# EAGLE design RAM_final_rev02 (EAGLE 9.6.0)
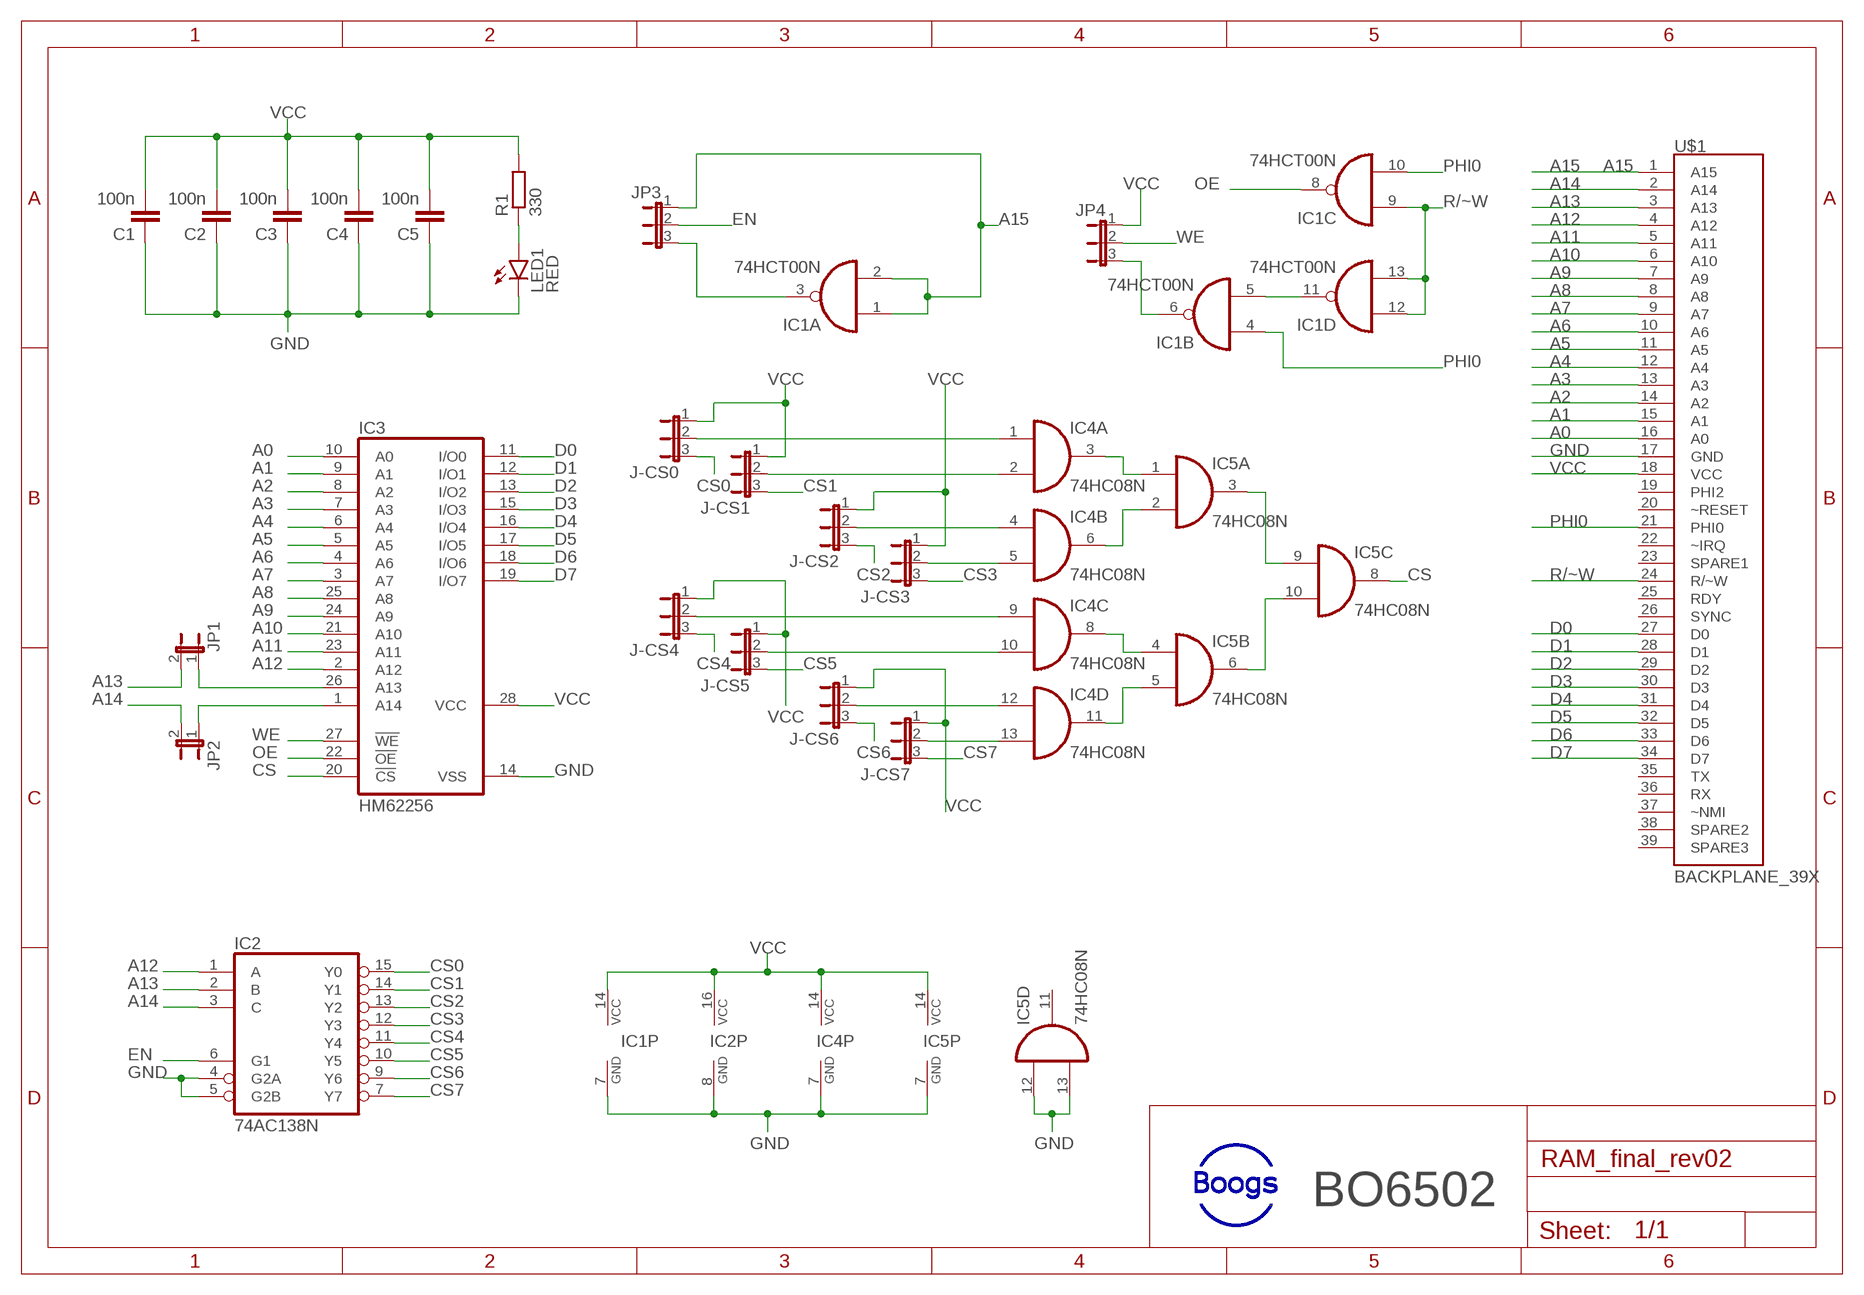
[diagram p0: schematic, sheet 1]

## Parts
C1  100n  C-EU025-025X050  [C025-025X050]
C2  100n  C-EU025-025X050  [C025-025X050]
C3  100n  C-EU025-025X050  [C025-025X050]
C4  100n  C-EU025-025X050  [C025-025X050]
C5  100n  C-EU025-025X050  [C025-025X050]
IC1  74HCT00N  [DIL14]
IC2  74AC138N  [DIL16]
IC3  HM62256  62256P  [DIL28-6]
IC4  74HC08N  [DIL14]
IC5  74HC08N  [DIL14]
J-CS0  J-CS0  JP2E  [JP2]
J-CS1  J-CS1  JP2E  [JP2]
J-CS2  J-CS2  JP2E  [JP2]
J-CS3  J-CS3  JP2E  [JP2]
J-CS4  J-CS4  JP2E  [JP2]
J-CS5  J-CS5  JP2E  [JP2]
J-CS6  J-CS6  JP2E  [JP2]
J-CS7  J-CS7  JP2E  [JP2]
JP1  JP1  JP1E  [JP1]
JP2  JP2  JP1E  [JP1]
JP3  JP3  JP2E  [JP2]
JP4  JP4  JP2E  [JP2]
LED1  RED  LED5MM  [LED5MM]
R1  330  R-EU_0207/10  [0207/10]
U$1  BACKPLANE_39X  [BP_39X]

## Nets
A0: IC3.10(A0) U$1.16(A0)
A1: IC3.9(A1) U$1.15(A1)
A2: IC3.8(A2) U$1.14(A2)
A3: IC3.7(A3) U$1.13(A3)
A4: IC3.6(A4) U$1.12(A4)
A5: IC3.5(A5) U$1.11(A5)
A6: IC3.4(A6) U$1.10(A6)
A7: IC3.3(A7) U$1.9(A7)
A8: IC3.25(A8) U$1.8(A8)
A9: IC3.24(A9) U$1.7(A9)
A10: IC3.21(A10) U$1.6(A10)
A11: IC3.23(A11) U$1.5(A11)
A12: IC2.1(A) IC3.2(A12) U$1.4(A12)
A13: IC2.2(B) JP1.2 U$1.3(A13)
A14: IC2.3(C) JP2.2 U$1.2(A14)
A15: IC1.1(A:I0) IC1.2(A:I1) JP3.1 U$1.1(A15)
CS: IC3.20(!CS) IC5.8(C:O)
CS0: IC2.15(Y0) J-CS0.3
CS1: IC2.14(Y1) J-CS1.3
CS2: IC2.13(Y2) J-CS2.3
CS3: IC2.12(Y3) J-CS3.3
CS4: IC2.11(Y4) J-CS4.3
CS5: IC2.10(Y5) J-CS5.3
CS6: IC2.9(Y6) J-CS6.3
CS7: IC2.7(Y7) J-CS7.3
D0: IC3.11(I/O0) U$1.27(D0)
D1: IC3.12(I/O1) U$1.28(D1)
D2: IC3.13(I/O2) U$1.29(D2)
D3: IC3.15(I/O3) U$1.30(D3)
D4: IC3.16(I/O4) U$1.31(D4)
D5: IC3.17(I/O5) U$1.32(D5)
D6: IC3.18(I/O6) U$1.33(D6)
D7: IC3.19(I/O7) U$1.34(D7)
EN: IC2.6(G1) JP3.2
GND: C1.1 C2.1 C3.1 C4.1 C5.1 IC1.7(P:GND) IC2.4(G2A) IC2.5(G2B) IC2.8(GND) IC3.14(VSS) IC4.7(P:GND) IC5.7(P:GND) IC5.12(D:I0) IC5.13(D:I1) LED1.K(C) U$1.17(GND)
N$1: IC3.26(A13) JP1.1
N$2: IC1.5(B:I1) IC1.11(D:O)
N$3: IC1.3(A:O) JP3.3
N$4: IC1.6(B:O) JP4.3
N$5: IC4.3(A:O) IC5.1(A:I0)
N$6: LED1.A R1.1
N$7: IC4.6(B:O) IC5.2(A:I1)
N$8: IC4.8(C:O) IC5.4(B:I0)
N$9: IC3.1(A14) JP2.1
N$10: IC4.11(D:O) IC5.5(B:I1)
N$11: IC5.3(A:O) IC5.9(C:I0)
N$12: IC5.6(B:O) IC5.10(C:I1)
N$13: IC4.1(A:I0) J-CS0.2
N$14: IC4.2(A:I1) J-CS1.2
N$15: IC4.4(B:I0) J-CS2.2
N$16: IC4.5(B:I1) J-CS3.2
N$17: IC4.9(C:I0) J-CS4.2
N$18: IC4.10(C:I1) J-CS5.2
N$19: IC4.12(D:I0) J-CS6.2
N$20: IC4.13(D:I1) J-CS7.2
OE: IC1.8(C:O) IC3.22(!OE)
PHI0: IC1.4(B:I0) IC1.10(C:I1) U$1.21(PHI0)
R/~W: IC1.9(C:I0) IC1.12(D:I0) IC1.13(D:I1) U$1.24(R/~W)
VCC: C1.2 C2.2 C3.2 C4.2 C5.2 IC1.14(P:VCC) IC2.16(VCC) IC3.28(VCC) IC4.14(P:VCC) IC5.14(P:VCC) J-CS0.1 J-CS1.1 J-CS2.1 J-CS3.1 J-CS4.1 J-CS5.1 J-CS6.1 J-CS7.1 JP4.1 R1.2 U$1.18(VCC)
WE: IC3.27(!WE) JP4.2
Unconnected: IC5.11(D:O) U$1.19(PHI2) U$1.20(~RESET) U$1.22(~IRQ) U$1.23(SPARE1) U$1.25(RDY) U$1.26(SYNC) U$1.35(TX) U$1.36(RX) U$1.37(~NMI) U$1.38(SPARE2) U$1.39(SPARE3)

## Notes on the sheet
- BO6502

## Library data of the parts
C1-C5 = rcl:C-EU: CAPACITOR, European symbol; SPICEPREFIX: C
IC1 = 74xx-eu:74*00: Quad 2-input NAND gate
IC2 = 74xx-eu:74*138: 3-line to 8-line DECODER/DEMULTIPLEXER
IC3 = memory-hitachi:62256P: MEMORY; OC_FARNELL: unknown; OC_NEWARK: unknown
IC4 IC5 = 74xx-eu:74*08: Quad 2-input AND gate
J-CS0 J-CS1-J-CS7 JP3 JP4 = jumper:JP2E: JUMPER
JP1 JP2 = jumper:JP1E: JUMPER
LED1 = led:LED: LED OSRAM: - CHIPLED LG R971, LG N971, LY N971, LG Q971, LY Q971, LO R971, LY R971 LH N974, LH R974 LS Q976, LO Q976, LY Q976 LO Q996 - Hyper CHIPLED LW Q18S LB Q993, LB Q99A, LB R99A - SideLED LS A670, LO A670, LY A670, LG A670, LP A670 LB A673, LV A673, LT A673, LW A673 LH A674 LY A675 LS A676, LA A676, LO A676, LY A676, LW A676 LS A679, LY A679, LG A679 - Hyper Micro SIDELED® LS Y876, LA Y876, LO Y876, LY Y876 LT Y87S - SmartLED LW L88C, LW L88S LB L89C, LB L89S, LG L890 LS L89K, LO L89K, LY L89K LS L896, LA L896, LO L896, LY L896 - TOPLED LS T670, LO T670, LY T670, LG T670, LP T670 LSG T670, LSP T670, LSY T670, LOP T670, LYG T670 LG T671, LOG T671, LSG T671 LB T673, LV T673, LT T673, LW T673 LH T674 LS T676, LA T676, LO T676, LY T676, LB T676, LH T676, LSB T676, LW T676 LB T67C, LV T67C, LT T67C, LS T67K, LO T67K, LY T67K, LW E67C LS E67B, LA E67B, LO E67B, LY E67B, LB E67C, LV E67C, LT E67C LW T67C LS T679, LY T679, LG T679 LS T770, LO T770, LY T770, LG T770, LP T770 LB T773, LV T773, LT T773, LW T773 LH T774 LS E675, LA E675, LY E675, LS T675 LS T776, LA T776, LO T776, LY T776, LB T776 LHGB T686 LT T68C, LB T68C - Hyper Mini TOPLED® LB M676 - Mini TOPLED Santana® LG M470 LS M47K, LO M47K, LY M47K Source: http://www.osram.convergy.de LUXEON: - LUMILED® LXK2-PW12-R00, LXK2-PW12-S00, LXK2-PW14-U00, LXK2-PW14-V00 LXK2-PM12-R00, LXK2-PM12-S00, LXK2-PM14-U00 LXK2-PE12-Q00, LXK2-PE12-R00, LXK2-PE12-S00, LXK2-PE14-T00, LXK2-PE14-U00 LXK2-PB12-K00, LXK2-PB12-L00, LXK2-PB12-M00, LXK2-PB14-N00, LXK2-PB14-P00, LXK2-PB14-Q00 LXK2-PR12-L00, LXK2-PR12-M00, LXK2-PR14-Q00, LXK2-PR14-R00 LXK2-PD12-Q00, LXK2-PD12-R00, LXK2-PD12-S00 LXK2-PH12-R00, LXK2-PH12-S00 LXK2-PL12-P00, LXK2-PL12-Q00, LXK2-PL12-R00 Source: www.luxeon.com KINGBRIGHT: KA-3528ASYC Source: www.kingbright.com
R1 = rcl:R-EU_: RESISTOR, European symbol; SPICEPREFIX: R
U$1 = 65xx_family:BACKPLANE_39X; A15: A15

## Board
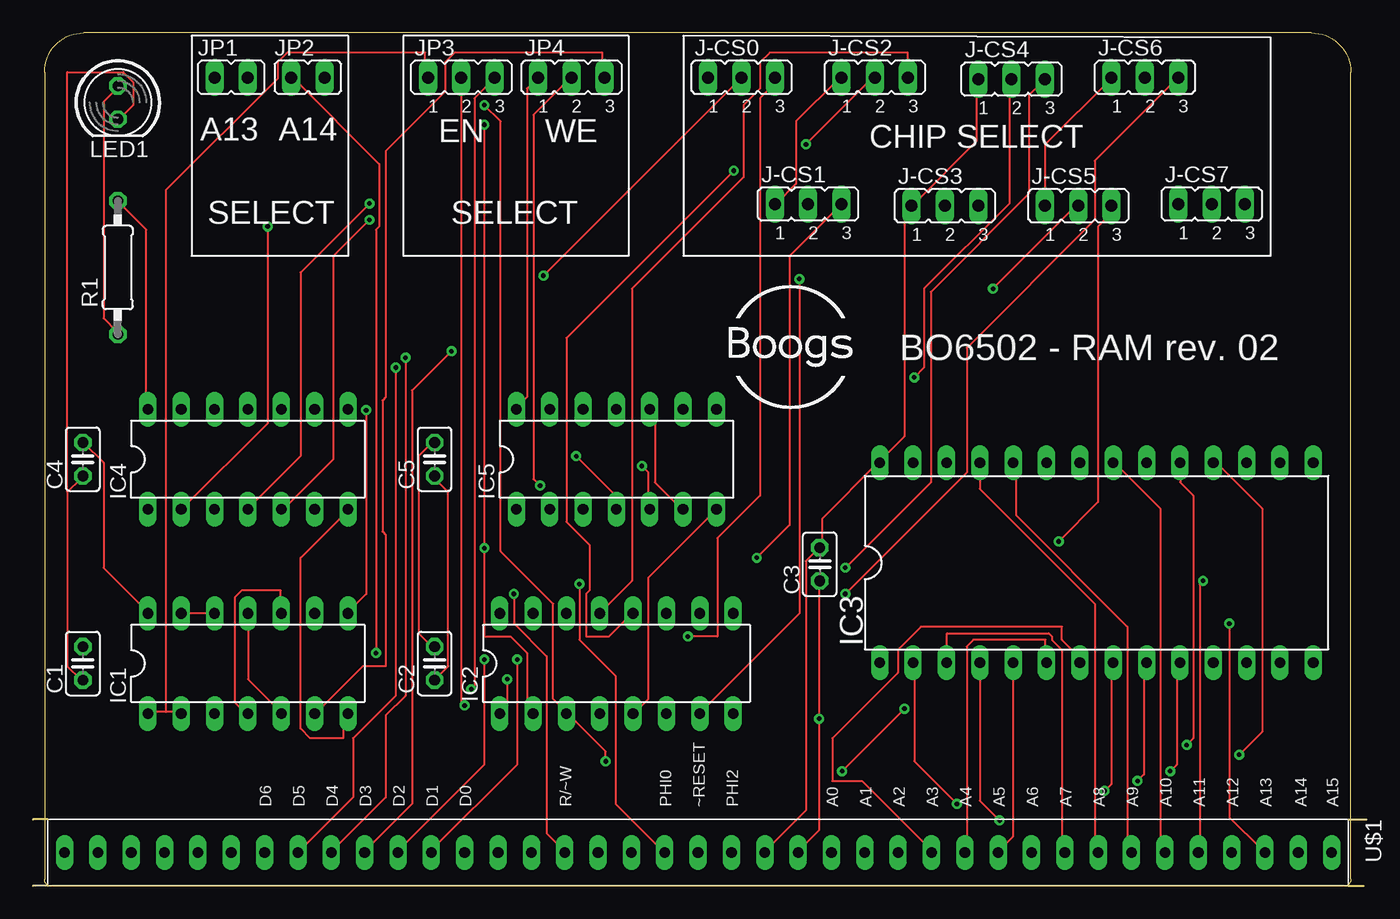
[diagram p1: board, top side]
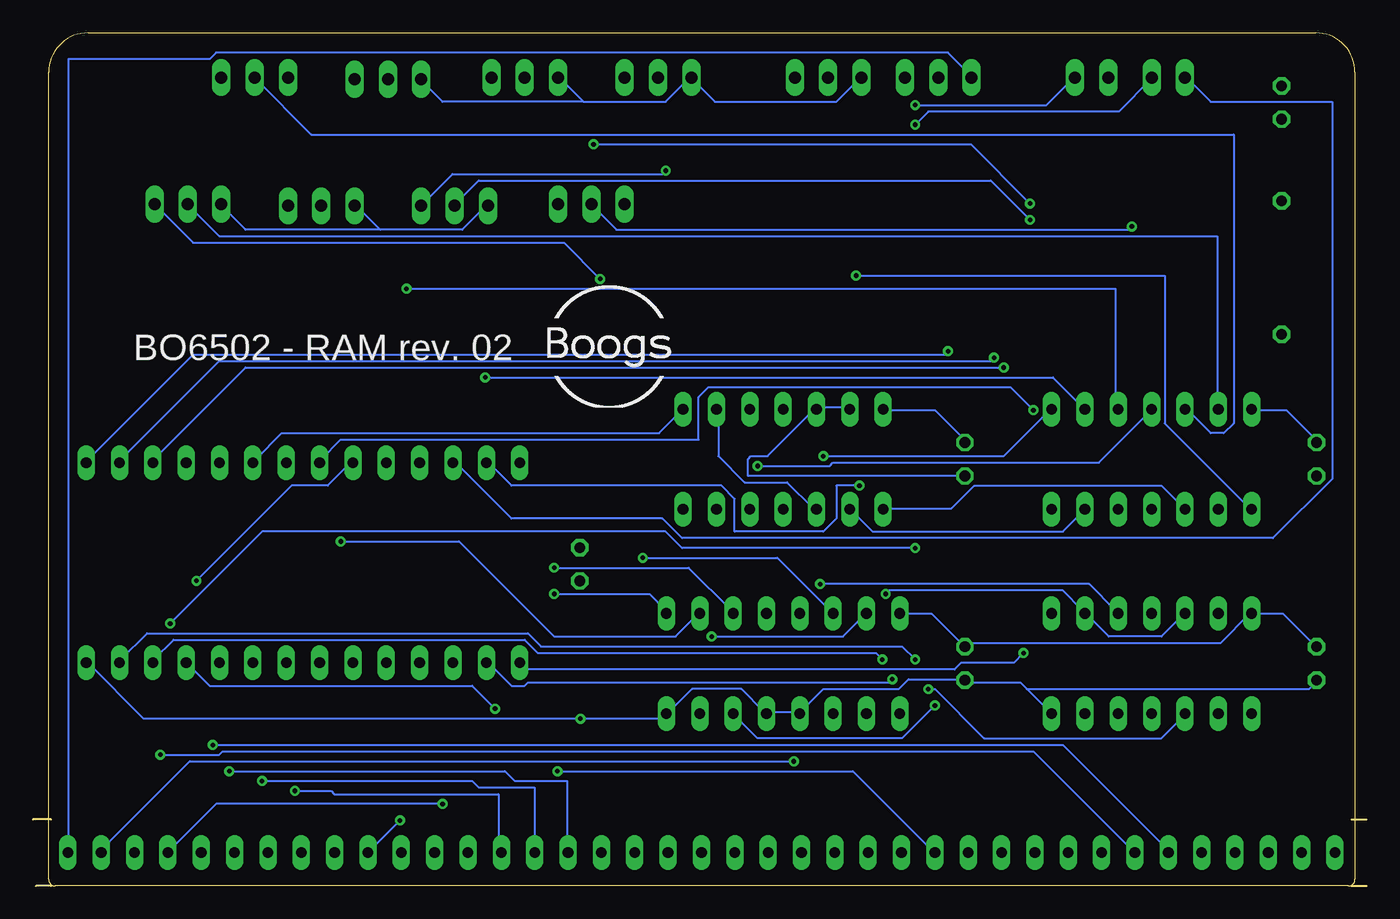
[diagram p2: board, bottom side, seen from below]

Size 101.6 x 65 mm. Coordinates in mm from the lower left corner, seen from the top.
Outline: 1.14,5.08 0,5.08
Outline: 1.14,0 0,0
Outline: 100.2,5.08 101.6,5.08
Outline: 100.2,0 101.35,0
Outline: 1.39,0 99.89,0 arc90 100.39,0.5 100.39,62 arc90 97.39,65 3.89,65 arc90 0.89,62 0.89,0.5 arc90 1.39,0
Copper layers (1*16): Top 0.035mm / dielectric 1.5mm / Bottom 0.035mm
Design rules "default *": minimum track width 6mil, minimum drill 0.35mm, track to track 10mil, track to pad 10mil, pad to pad 10mil, via to via 10mil, smd to smd 6mil, copper to edge 40mil, drill to drill 6mil, minimum pad ring 10mil, minimum via ring 8mil, stop-mask expansion 4mil, vias tented up to drill 15mil, thermal gap 10mil

### Footprints (pad centres in the part's own frame; a part is rotated, then mirrored left to right if it is on the bottom)
C025-025X050 = drill 0.813 octagon: 1 -1.27,0; 2 1.27,0
DIL14 = drill 0.813 long: 1 -7.62,-3.81; 2 -5.08,-3.81; 3 -2.54,-3.81; 4 0,-3.81; 5 2.54,-3.81; 6 5.08,-3.81; 7 7.62,-3.81; 8 7.62,3.81; 9 5.08,3.81; 10 2.54,3.81; 11 0,3.81; 12 -2.54,3.81; 13 -5.08,3.81; 14 -7.62,3.81
DIL16 = drill 0.813 long: 1 -8.89,-3.81; 2 -6.35,-3.81; 3 -3.81,-3.81; 4 -1.27,-3.81; 5 1.27,-3.81; 6 3.81,-3.81; 7 6.35,-3.81; 8 8.89,-3.81; 9 8.89,3.81; 10 6.35,3.81; 11 3.81,3.81; 12 1.27,3.81; 13 -1.27,3.81; 14 -3.81,3.81; 15 -6.35,3.81; 16 -8.89,3.81
DIL28-6 = drill 0.813 long: 1 -16.51,-7.62; 2 -13.97,-7.62; 3 -11.43,-7.62; 4 -8.89,-7.62; 5 -6.35,-7.62; 6 -3.81,-7.62; 7 -1.27,-7.62; 8 1.27,-7.62; 9 3.81,-7.62; 10 6.35,-7.62; 11 8.89,-7.62; 12 11.43,-7.62; 13 13.97,-7.62; 14 16.51,-7.62; 15 16.51,7.62; 16 13.97,7.62; 17 11.43,7.62; 18 8.89,7.62; 19 6.35,7.62; 20 3.81,7.62; 21 1.27,7.62; 22 -1.27,7.62; 23 -3.81,7.62; 24 -6.35,7.62; 25 -8.89,7.62; 26 -11.43,7.62; 27 -13.97,7.62; 28 -16.51,7.62
JP2 = drill 0.914 long: 1 -2.54,0; 2 0,0; 3 2.54,0
JP1 = drill 0.914 long: 1 0,-1.27; 2 0,1.27
LED5MM = drill 0.813 octagon: A -1.27,0; K 1.27,0
0207/10 = drill 0.813 octagon: 1 -5.08,0; 2 5.08,0
BP_39X = drill 0.813 long: 1 1.27,59.69; 2 1.27,57.15; 3 1.27,54.61; 4 1.27,52.07; 5 1.27,49.53; 6 1.27,46.99; 7 1.27,44.45; 8 1.27,41.91; 9 1.27,39.37; 10 1.27,36.83; 11 1.27,34.29; 12 1.27,31.75; 13 1.27,29.21; 14 1.27,26.67; 15 1.27,24.13; 16 1.27,21.59; 17 1.27,19.05; 18 1.27,16.51; 19 1.27,13.97; 20 1.27,11.43; 21 1.27,8.89; 22 1.27,6.35; 23 1.27,3.81; 24 1.27,1.27; 25 1.27,-1.27; 26 1.27,-3.81; 27 1.27,-6.35; 28 1.27,-8.89; 29 1.27,-11.43; 30 1.27,-13.97; 31 1.27,-16.51; 32 1.27,-19.05; 33 1.27,-21.59; 34 1.27,-24.13; 35 1.27,-26.67; 36 1.27,-29.21; 37 1.27,-31.75; 38 1.27,-34.29; 39 1.27,-36.83

### Placement (x,y rotation side)
C1  3.81,16.95 90 top
C2  30.61,16.95 90 top
C3  59.94,24.51 90 top
C4  3.81,32.51 90 top
C5  30.61,32.51 90 top
IC1  16.38,16.95 0 top
IC2  44.45,16.95 0 top
IC3  81.03,24.64 0 top
IC4  16.38,32.51 0 top
IC5  44.45,32.51 0 top
J-CS0  53.98,61.59 0 top
J-CS1  59.05,51.94 0 top
J-CS2  64.14,61.59 0 top
J-CS3  69.47,51.82 0 top
J-CS4  74.55,61.47 0 top
J-CS5  79.63,51.82 0 top
J-CS6  84.71,61.59 0 top
J-CS7  89.79,51.94 0 top
JP1  15.11,61.59 270 top
JP2  20.95,61.59 270 top
JP3  32.64,61.59 0 top
JP4  41.02,61.59 0 top
LED1  6.48,59.69 270 top
R1  6.48,47.12 90 top
U$1  39.24,3.81 270 top

### Tracks (layer width: path | path; a pad name or v marks a point on that pad's centre or on a via)
A0  (via drill 0.35)
  Top 0.152: v86.64,8.75 87.14,9.25 87.14,17 IC3.10
  Bottom 0.152: v86.64,8.75 65.64,8.75 64.89,8 60.89,8 60.89,2.75 U$1.16
A1  (via drill 0.35)
  Top 0.152: v84.14,8 84.64,8.5 84.64,17 IC3.9
  Bottom 0.152: v84.14,8 68.14,8 67.64,7.5 63.39,7.5 63.39,2.75 U$1.15
A2  (via drill 0.35)
  Top 0.152: v81.64,7.25 82.14,7.75 82.14,17 IC3.8
  Bottom 0.152: v81.64,7.25 78.89,7.25 78.64,7 66.14,7 66.14,2.75 U$1.14
A3
  Top 0.152: U$1.13 68.39,2.75 63.14,8 60.89,8 60.89,11.25 65.89,16.25 65.89,18 67.64,19.75 78.39,19.75 78.39,18.75 79.64,17.5 79.64,17.25 IC3.7
A4
  Top 0.152: U$1.12 71.14,2.75 71.14,18.25 71.64,18.75 77.14,18.75 77.14,17.25 IC3.6
A5
  Top 0.152: U$1.11 73.64,2.75 74.64,3.75 74.64,17 IC3.5
A6  (via drill 0.35)
  Top 0.152: v73.64,5 72.14,6.5 72.14,17 IC3.4
  Bottom 0.152: v73.64,5 75.89,2.75 U$1.10
A7
  Top 0.152: U$1.9 78.39,2.75 78.39,18 77.64,18.75 77.64,19 77.39,19.25 69.64,19.25 69.64,17.25 IC3.3
A8
  Top 0.152: U$1.8 81.14,2.75 80.89,3 80.89,21.5 72.14,30.25 IC3.25
A9
  Top 0.152: U$1.7 83.64,2.75 83.39,3 83.39,19.75 74.89,28.25 74.89,32.25 IC3.24
A10
  Top 0.152: U$1.6 86.14,2.75 85.89,3 85.89,28.75 82.39,32.25 IC3.21
A11  (via drill 0.35)
  Top 0.152: v89.14,23.25 88.89,23 88.89,2.75 U$1.5
  Bottom 0.152: v89.14,23.25 81.89,30.5 79.14,30.5 77.39,32.25 IC3.23
A12  (via drill 0.35)
  Top 0.152: v36.14,15.75 36.14,13.75 35.64,13.25 IC2.1 | v70.39,6.25 67.14,9.5 67.14,17 IC3.2
  Bottom 0.152: v36.14,15.75 36.39,15.5 63.89,15.5 64.14,15.25 65.14,15.25 66.89,17 IC3.2 | v70.39,6.25 87.64,6.25 91.14,2.75 U$1.4
A13  (via drill 0.35)
  Top 0.152: v34.39,58 v34.39,25.75 34.39,19 36.39,19 37.64,17.75 37.64,13.5 37.89,13.25 IC2.2 | v91.14,20 91.14,5.25 93.64,2.75 U$1.3
  Bottom 0.152: v34.39,58 33.39,59 18.89,59 16.39,61.5 JP1.2 | v91.14,20 84.14,27 53.39,27 52.14,25.75 v34.39,25.75
A14  (via drill 0.35)
  Top 0.152: v43.64,9.5 43.64,10.25 40.89,13 IC2.3 40.64,13.25 39.64,14.25 39.64,21.5 35.64,25.5 35.64,58.25 v34.39,59.5
  Bottom 0.152: v43.64,9.5 89.64,9.5 96.39,2.75 U$1.2 | v34.39,59.5 24.39,59.5 22.39,61.5 JP2.2
A15
  Top 0.152: 10.14,13.25 11.14,13.25 IC1.2 | 10.14,13.25 8.89,13.25 IC1.1 | 10.14,13.25 10.14,53 18.64,61.5 18.64,62.75 19.39,63.5 29.89,63.5 29.89,61.75 JP3.1
  Bottom 0.152: U$1.1 98.89,2.75 98.89,63 88.14,63 87.64,63.5 31.89,63.5 30.14,61.75 JP3.1
CS
  Bottom 0.152: IC5.8 52.14,36.25 53.89,34.5 82.64,34.5 84.64,32.5 IC3.20
CS0  (via drill 0.35)
  Top 0.152: v49.89,19 52.14,19 52.14,26.5 55.39,29.75 55.39,60 56.39,61 56.39,61.5 J-CS0.3
  Bottom 0.152: v49.89,19 39.89,19 38.14,20.75 IC2.15
CS1  (via drill 0.35)
  Top 0.152: v55.14,25 57.64,27.5 57.64,48 61.39,51.75 J-CS1.3
  Bottom 0.152: v55.14,25 44.89,25 40.89,21 IC2.14
CS2
  Top 0.152: IC2.13 43.39,21 45.64,23.25 45.64,45.5 54.14,54 54.14,59.5 55.39,60.75 55.39,62.75 56.14,63.5 66.64,63.5 66.64,61.75 J-CS2.3
CS3  (via drill 0.35)
  Top 0.152: v53.39,54.5 40.64,41.75 40.64,27.75 42.39,26 42.39,22.5 42.14,22.25 42.14,19 43.89,19 45.64,20.75 IC2.12
  Bottom 0.152: v53.39,54.5 53.64,54.25 69.64,54.25 71.89,52 J-CS3.3
CS4  (via drill 0.35)
  Top 0.152: v61.89,24.25 68.39,30.75 68.39,45.25 75.89,52.75 75.89,60.25 76.89,61.25 J-CS4.3
  Bottom 0.152: v61.89,24.25 51.64,24.25 48.39,21 IC2.11
CS5  (via drill 0.35)
  Top 0.152: v78.14,26.25 81.14,29.25 81.14,50.25 82.14,51.25 82.14,51.75 J-CS5.3
  Bottom 0.152: v78.14,26.25 69.14,26.25 61.89,19 52.64,19 50.89,20.75 IC2.10
CS6  (via drill 0.35)
  Top 0.152: v61.89,22.25 71.14,31.5 71.14,41 80.89,50.75 80.89,55.25 87.14,61.5 J-CS6.3
  Bottom 0.152: v61.89,22.25 54.64,22.25 53.39,21 IC2.9
CS7  (via drill 0.35)
  Top 0.152: v58.39,46.25 58.39,20.75 50.89,13.25 IC2.7
  Bottom 0.152: v58.39,46.25 61.14,49 89.39,49 92.14,51.75 J-CS7.3
D0  (via drill 0.35)
  Top 0.152: v66.39,13.5 v61.64,8.75
  Bottom 0.152: v61.64,8.75 39.14,8.75 33.14,2.75 U$1.27 | v66.39,13.5 68.14,15.25 88.14,15.25 89.89,17 IC3.11
D1  (via drill 0.35)
  Top 0.152: v36.89,17.25 36.89,9.25 30.39,2.75 U$1.28
  Bottom 0.152: v36.89,17.25 37.39,17.75 63.14,17.75 64.14,18.75 90.89,18.75 92.39,17.25 IC3.12
D2  (via drill 0.35)
  Top 0.152: v34.39,17.25 34.39,9.25 27.89,2.75 U$1.29
  Bottom 0.152: v34.39,17.25 35.39,18.25 62.89,18.25 63.89,19.25 92.89,19.25 94.89,17.25 IC3.13
D3  (via drill 0.35)
  Top 0.152: v31.89,40.75 28.89,37.75 28.89,6.25 25.39,2.75 U$1.30
  Bottom 0.152: v31.89,40.75 32.14,40.5 89.39,40.5 97.39,32.5 IC3.15
D4  (via drill 0.35)
  Top 0.152: v28.39,40.25 28.39,14.5 26.89,13 26.89,6.75 22.89,2.75 U$1.31
  Bottom 0.152: v28.39,40.25 28.64,40 87.39,40 94.89,32.5 IC3.16
D5  (via drill 0.35)
  Top 0.152: v27.64,39.5 27.64,14.5 24.39,11.25 24.39,6.75 20.39,2.75 U$1.32
  Bottom 0.152: v27.64,39.5 85.39,39.5 92.39,32.5 IC3.17
D6  (via drill 0.35)
  Top 0.152: v91.89,10 93.64,11.75 93.64,28.75 90.14,32.25 IC3.18
  Bottom 0.152: v91.89,10 87.39,10 87.14,10.25 25.39,10.25 17.89,2.75 U$1.33
D7  (via drill 0.35)
  Top 0.152: v87.89,10.75 88.39,11.25 88.39,29.75 87.39,30.75 IC3.19
  Bottom 0.152: v87.89,10.75 23.14,10.75 15.14,2.75 U$1.34
EN  (via drill 0.35)
  Top 0.152: v32.89,13.75 32.64,14 JP3.2
  Bottom 0.152: v32.89,13.75 35.39,11.25 46.39,11.25 48.14,13 IC2.6
GND  (via drill 0.35)
  Top 0.152: 2.64,30 2.64,16.75 3.64,15.75 C1.1 | 2.64,30 3.64,31 C4.1 | 2.64,30 2.64,62 6.89,62 7.64,61.25 7.64,59.5 6.64,58.5 LED1.K | IC4.7 23.89,28.5 20.39,25 20.39,12 21.14,11.25 23.64,11.25 23.64,12.75 23.89,13 IC1.7 | C5.1 30.64,31 31.64,30 31.64,16.75 30.64,15.75 C2.1 | U$1.17 58.39,2.75 59.89,4.25 v59.89,12.75 59.89,23 C3.1 | IC5.7 51.89,28.5 46.89,23.5 46.89,14.25 45.89,13.25 IC2.5
  Bottom 0.152: IC5.13 39.39,36.5 41.89,36.5 IC5.12 42.14,36.25 45.64,32.75 46.89,32.75 47.14,32.5 47.14,31.25 30.64,31.25 C5.1 | 25.89,15 26.39,15.5 30.39,15.5 C2.1 30.64,15.75 34.89,15.75 35.64,15 41.39,15 43.14,13.25 IC2.4 43.39,13.25 45.64,13.25 IC2.5 45.89,13.25 47.64,15 51.39,15 53.14,13.25 IC2.8 53.39,13 53.64,12.75 v59.89,12.75 93.14,12.75 97.39,17 IC3.14 | 25.89,15 24.14,13.25 IC1.7 | 25.89,15 4.39,15 3.89,15.5 C1.1
N$1
  Bottom 0.152: IC3.26 69.39,32.25 65.14,28 53.64,28 52.14,26.5 7.14,26.5 2.64,31 2.64,59.75 11.89,59.75 13.64,61.5 JP1.1
N$2
  Top 0.152: IC1.5 18.89,13.25 16.39,15.75 IC1.11
N$3  (via drill 0.35)
  Top 0.152: v33.39,15 33.64,15.25 33.64,60 35.14,61.5 JP3.3
  Bottom 0.152: v33.39,15 32.89,15 29.14,11.25 15.64,11.25 13.89,13 IC1.3
N$4
  Top 0.152: IC1.6 21.64,13.25 25.14,16.75 26.89,16.75 26.89,26.75 26.64,27 26.64,37 26.89,37.25 26.89,56 31.39,60.5 31.39,62.75 32.14,63.5 43.39,63.5 43.39,61.75 JP4.3
N$5
  Bottom 0.152: IC4.3 13.89,28.75 15.64,30.5 29.89,30.5 31.64,28.75 36.64,28.75 IC5.1
N$6
  Top 0.152: R1.1 6.39,42.25 5.39,43.25 5.39,59.75 6.39,60.75 LED1.A
N$7
  Bottom 0.152: IC4.6 21.64,28.5 23.14,27 37.64,27 39.14,28.5 IC5.2
N$8  (via drill 0.35)
  Top 0.152: v41.39,32.75 44.39,29.75 44.39,28.75 IC5.4
  Bottom 0.152: v41.39,32.75 27.64,32.75 24.14,36.25 IC4.8
N$9  (via drill 0.35)
  Top 0.152: v26.14,17.75 26.14,50 26.39,50.25 26.39,55 19.89,61.5 JP2.1
  Bottom 0.152: v26.14,17.75 26.89,17 30.89,17 31.39,16.5 63.89,16.5 64.39,17 IC3.1
N$10  (via drill 0.35)
  Top 0.152: v46.39,32 46.89,31.5 46.89,28.75 IC5.5
  Bottom 0.152: v46.39,32 40.89,32 40.64,32.25 20.39,32.25 16.39,36.25 IC4.11
N$11
  Bottom 0.152: IC5.3 42.14,28.75 44.14,30.75 47.39,30.75 49.39,32.75 49.39,36.25 IC5.9
N$12
  Top 0.152: IC5.6 49.39,28.75 47.39,30.75 47.39,36 47.14,36.25 IC5.10
N$13  (via drill 0.35)
  Top 0.152: v38.89,46.5 53.89,61.5 J-CS0.2
  Bottom 0.152: v38.89,46.5 15.39,46.5 15.39,35.25 8.89,28.75 IC4.1
N$14  (via drill 0.35)
  Top 0.152: v17.89,50.25 17.89,35.25 11.39,28.75 IC4.2
  Bottom 0.152: v17.89,50.25 18.14,50 57.14,50 58.89,51.75 J-CS1.2
N$15  (via drill 0.35)
  Top 0.152: v25.64,52 20.39,46.75 20.39,32.75 16.39,28.75 IC4.4 | v58.89,56.5 63.89,61.5 J-CS2.2
  Bottom 0.152: v25.64,52 30.14,56.5 v58.89,56.5
N$16  (via drill 0.35)
  Top 0.152: v25.64,50.75 22.89,48 22.89,32.5 19.14,28.75 IC4.5
  Bottom 0.152: v25.64,50.75 28.64,53.75 67.64,53.75 69.39,52 J-CS3.2
N$17  (via drill 0.35)
  Top 0.152: v67.14,38.75 67.89,39.5 67.89,45.5 74.39,52 74.39,61.25 J-CS4.2
  Bottom 0.152: v67.14,38.75 23.89,38.75 21.64,36.5 IC4.9
N$18  (via drill 0.35)
  Top 0.152: v73.14,45.5 79.39,51.75 J-CS5.2
  Bottom 0.152: v73.14,45.5 19.14,45.5 19.14,36.5 IC4.10
N$19
  Bottom 0.152: IC4.12 13.64,36.25 11.89,34.5 10.89,34.5 10.14,35.25 10.14,57.25 80.39,57.25 84.64,61.5 J-CS6.2
N$20
  Bottom 0.152: IC4.13 11.39,36.5 11.39,49.5 87.39,49.5 89.64,51.75 J-CS7.2
OE  (via drill 0.35)
  Top 0.152: v25.39,36.25 25.39,22.25 24.14,21 IC1.8
  Bottom 0.152: v25.39,36.25 27.14,38 50.14,38 50.89,37.25 50.89,34 78.14,34 79.64,32.5 IC3.22
PHI0  (via drill 0.35)
  Top 0.152: IC1.4 16.14,13.25 15.39,14 15.39,22 15.89,22.5 18.89,22.5 18.89,21 IC1.10 | v41.64,23 41.64,18.75 44.39,16 44.39,6.25 47.89,2.75 U$1.21
  Bottom 0.152: v41.64,23 21.14,23 19.14,21 IC1.10
R/~W  (via drill 0.35)
  Top 0.152: IC1.13 11.39,20.75 13.64,20.75 IC1.12 | v36.64,22.25 36.64,20 39.14,17.5 39.14,4 40.39,2.75 U$1.24
  Bottom 0.152: IC1.12 13.89,20.75 15.64,19 19.64,19 21.39,20.75 IC1.9 21.64,21 23.14,22.5 36.39,22.5 v36.64,22.25
VCC
  Top 0.152: C2.2 30.39,18.25 29.39,19.25 29.39,32.75 30.39,33.75 C5.2 | R1.2 6.64,52 8.64,50 8.64,36.5 IC4.14 | IC1.14 8.64,21 5.39,24.25 5.39,32.25 3.89,33.75 C4.2 | U$1.18 55.89,2.75 58.89,5.75 58.89,24.75 59.89,25.75 C3.2 60.14,26 60.14,28 64.39,32.25 IC3.28 64.64,32.5 66.39,34.25 66.39,51.25 66.89,51.75 J-CS3.1 67.14,52 71.89,56.75 71.89,61.25 J-CS4.1 | J-CS6.1 82.14,61.5 77.14,56.5 77.14,52 J-CS5.1 | J-CS1.1 56.64,52 58.14,53.5 58.14,58.25 61.39,61.5 J-CS2.1 | IC5.14 36.89,36.5 37.64,37.25 37.64,60.75 38.39,61.5 JP4.1
  Bottom 0.152: IC2.16 35.39,20.75 33.14,20.75 30.64,18.25 C2.2 30.39,18.25 30.14,18.5 11.14,18.5 8.89,20.75 IC1.14 8.64,20.75 6.39,20.75 3.89,18.25 C1.2 | C5.2 30.64,34 32.89,36.25 36.64,36.25 IC5.14 | C4.2 3.89,34 6.14,36.25 8.64,36.25 IC4.14 | 75.14,50 76.89,51.75 J-CS5.1 | 75.14,50 68.89,50 67.14,51.75 J-CS3.1 | 75.14,50 85.39,50 87.14,51.75 J-CS7.1 | JP4.1 38.64,61.5 40.39,59.75 49.64,59.75 51.39,61.5 J-CS0.1 51.64,61.5 53.39,59.75 59.64,59.75 | 59.64,59.75 61.39,61.5 J-CS2.1 | 59.64,59.75 70.39,59.75 71.89,61.25 J-CS4.1
WE  (via drill 0.35)
  Top 0.152: v38.64,30.5 38.14,31 38.14,58.75 40.89,61.5 JP4.2
  Bottom 0.152: v38.64,30.5 40.39,30.5 40.39,28 41.39,27 48.14,27 48.14,29.5 49.14,30.5 65.14,30.5 66.89,32.25 IC3.27

### Text on the board
tNames: A13 | A14 | EN | WE | CHIP SELECT | SELECT | SELECT | BO6502 - RAM rev. 02 | D6 | D5 | D4 | D3 | D2 | D1 | D0 | R/~W | PHI0 | ~RESET | PHI2 | A0 | A1 | A2 | A3 | A4 | A5 | A6 | A7 | A8 | A9 | A10 | A11 | A12 | A13 | A14 | A15
bNames: BO6502 - RAM rev. 02